# EAGLE design DeviceDOut8 (EAGLE 5.00)
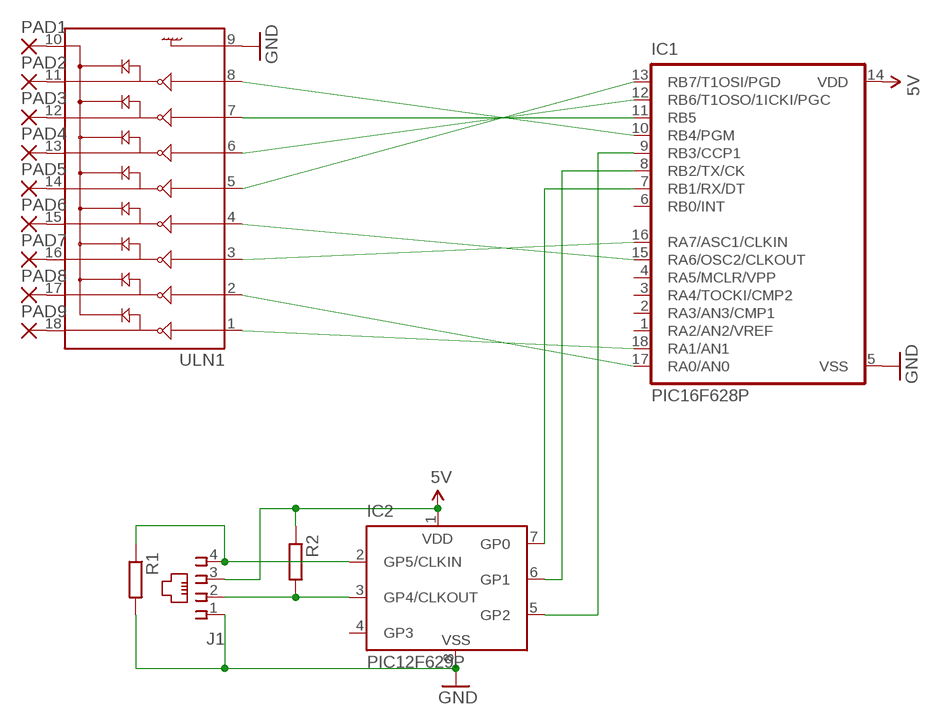
[diagram p0: schematic, sheet 1]

## Parts
IC1  PIC16F628P  [DIL18]
IC2  PIC12F629P  [DIL8]
J1  215875-3  [215875-3]
PAD1  2,15/1,0  [2,15/1,0]
PAD2  2,15/1,0  [2,15/1,0]
PAD3  2,15/1,0  [2,15/1,0]
PAD4  2,15/1,0  [2,15/1,0]
PAD5  2,15/1,0  [2,15/1,0]
PAD6  2,15/1,0  [2,15/1,0]
PAD7  2,15/1,0  [2,15/1,0]
PAD8  2,15/1,0  [2,15/1,0]
PAD9  2,15/1,0  [2,15/1,0]
R1  R-EU_0204/5  [0204/5]
R2  R-EU_0204/5  [0204/5]
ULN1  ULN2803DIP  [DIL18]

## Nets
5V: IC1.14(VDD) IC2.1(VDD) J1.3 R2.1
GND: IC1.5(VSS) IC2.8(VSS) J1.1 R1.2 ULN1.9
N$1: PAD1.1(P) ULN1.10
N$2: PAD2.1(P) ULN1.11
N$3: PAD3.1(P) ULN1.12
N$4: PAD4.1(P) ULN1.13
N$5: PAD5.1(P) ULN1.14
N$6: PAD6.1(P) ULN1.15
N$7: PAD7.1(P) ULN1.16
N$8: PAD8.1(P) ULN1.17
N$9: PAD9.1(P) ULN1.18
N$10: IC1.18(RA1/AN1) ULN1.1
N$11: IC2.3(GP4/CLKOUT) J1.2 R2.2
N$12: IC1.17(RA0/AN0) ULN1.2
N$13: IC1.16(RA7/ASC1/CLKIN) ULN1.3
N$14: IC1.15(RA6/OSC2/CLKOUT) ULN1.4
N$15: IC1.13(RB7/T1OSI/PGD) ULN1.5
N$16: IC1.12(RB6/T1OSO/1ICKI/PGC) ULN1.6
N$17: IC1.11(RB5) ULN1.7
N$18: IC1.10(RB4/PGM) ULN1.8
N$20: IC1.7(RB1/RX/DT) IC2.7(GP0)
N$21: IC1.8(RB2/TX/CK) IC2.6(GP1)
N$22: IC1.9(RB3/CCP1) IC2.5(GP2)
N$25: IC2.2(GP5/CLKIN) J1.4 R1.1
Unconnected: IC1.1(RA2/AN2/VREF) IC1.2(RA3/AN3/CMP1) IC1.3(RA4/TOCKI/CMP2) IC1.4(RA5/MCLR/VPP) IC1.6(RB0/INT) IC2.4(GP3)

## Library data of the parts
IC1 = microchip:PIC16*F62: FLASH-Based 8-Bit CMOS Microcontroller Source: http://ww1.microchip.com/downloads/en/DeviceDoc/40300C.pdf
IC2 = microchip:PIC12F6*: Data Sheet 8-Pin FLASH-Based 8-Bit CMOS Microcontrollers Source: http://www.microchip.com .. 41190c.pdf
J1 = con-amp:215875-3: AMP connector
PAD1-PAD9 = wirepad:2,15/1,0: THROUGH-HOLE PAD
R1 R2 = resistor:R-EU_: RESISTOR, European symbol
ULN1 = SparkFun:ULN2803: Darlington Driver ULN2803 Darlington array. 500mA max per channel, 8-channel package. Spark Fun Electronics SKU : COM-00312

## Board
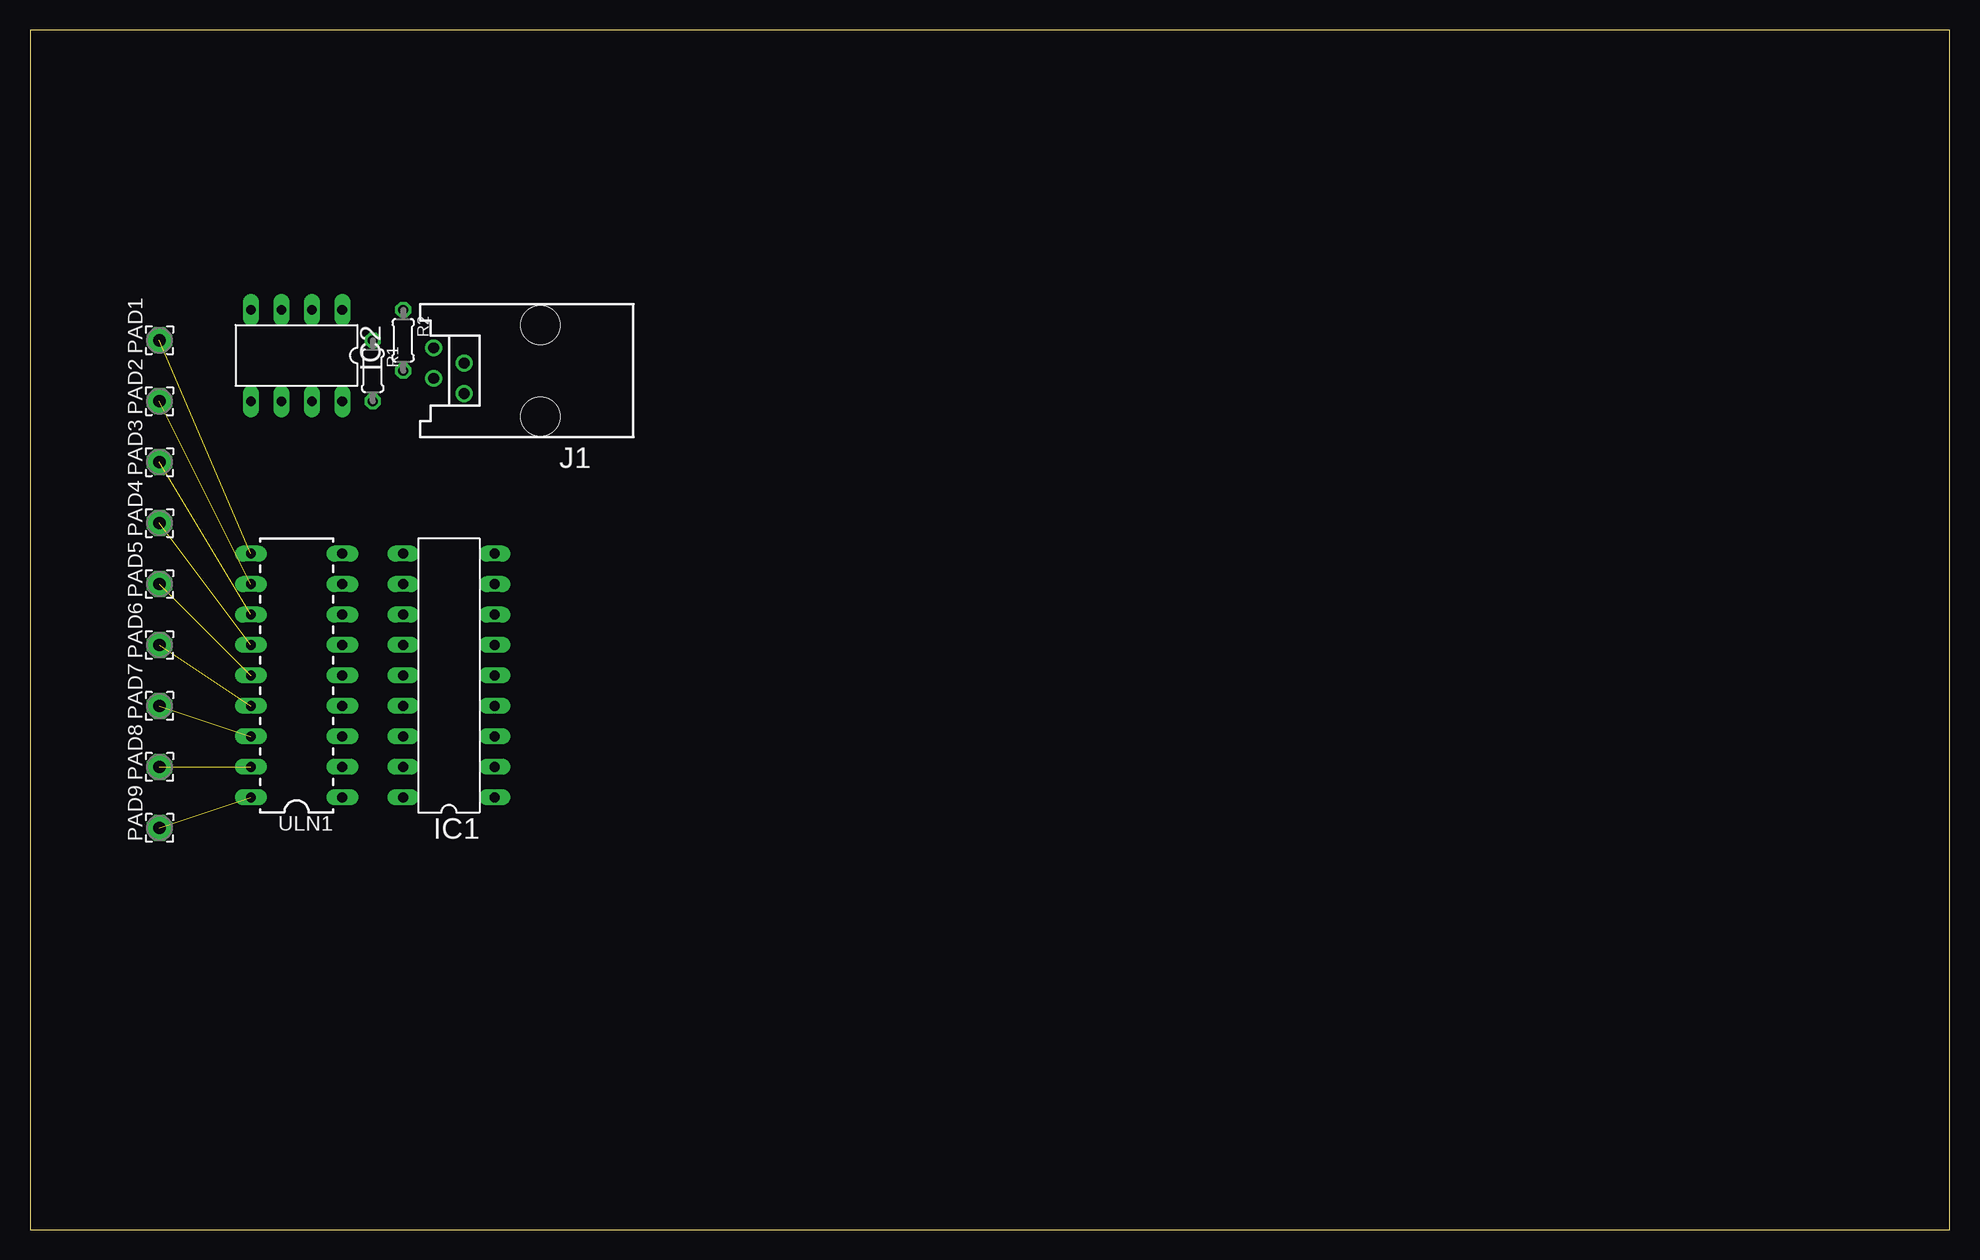
[diagram p1: board, top side]
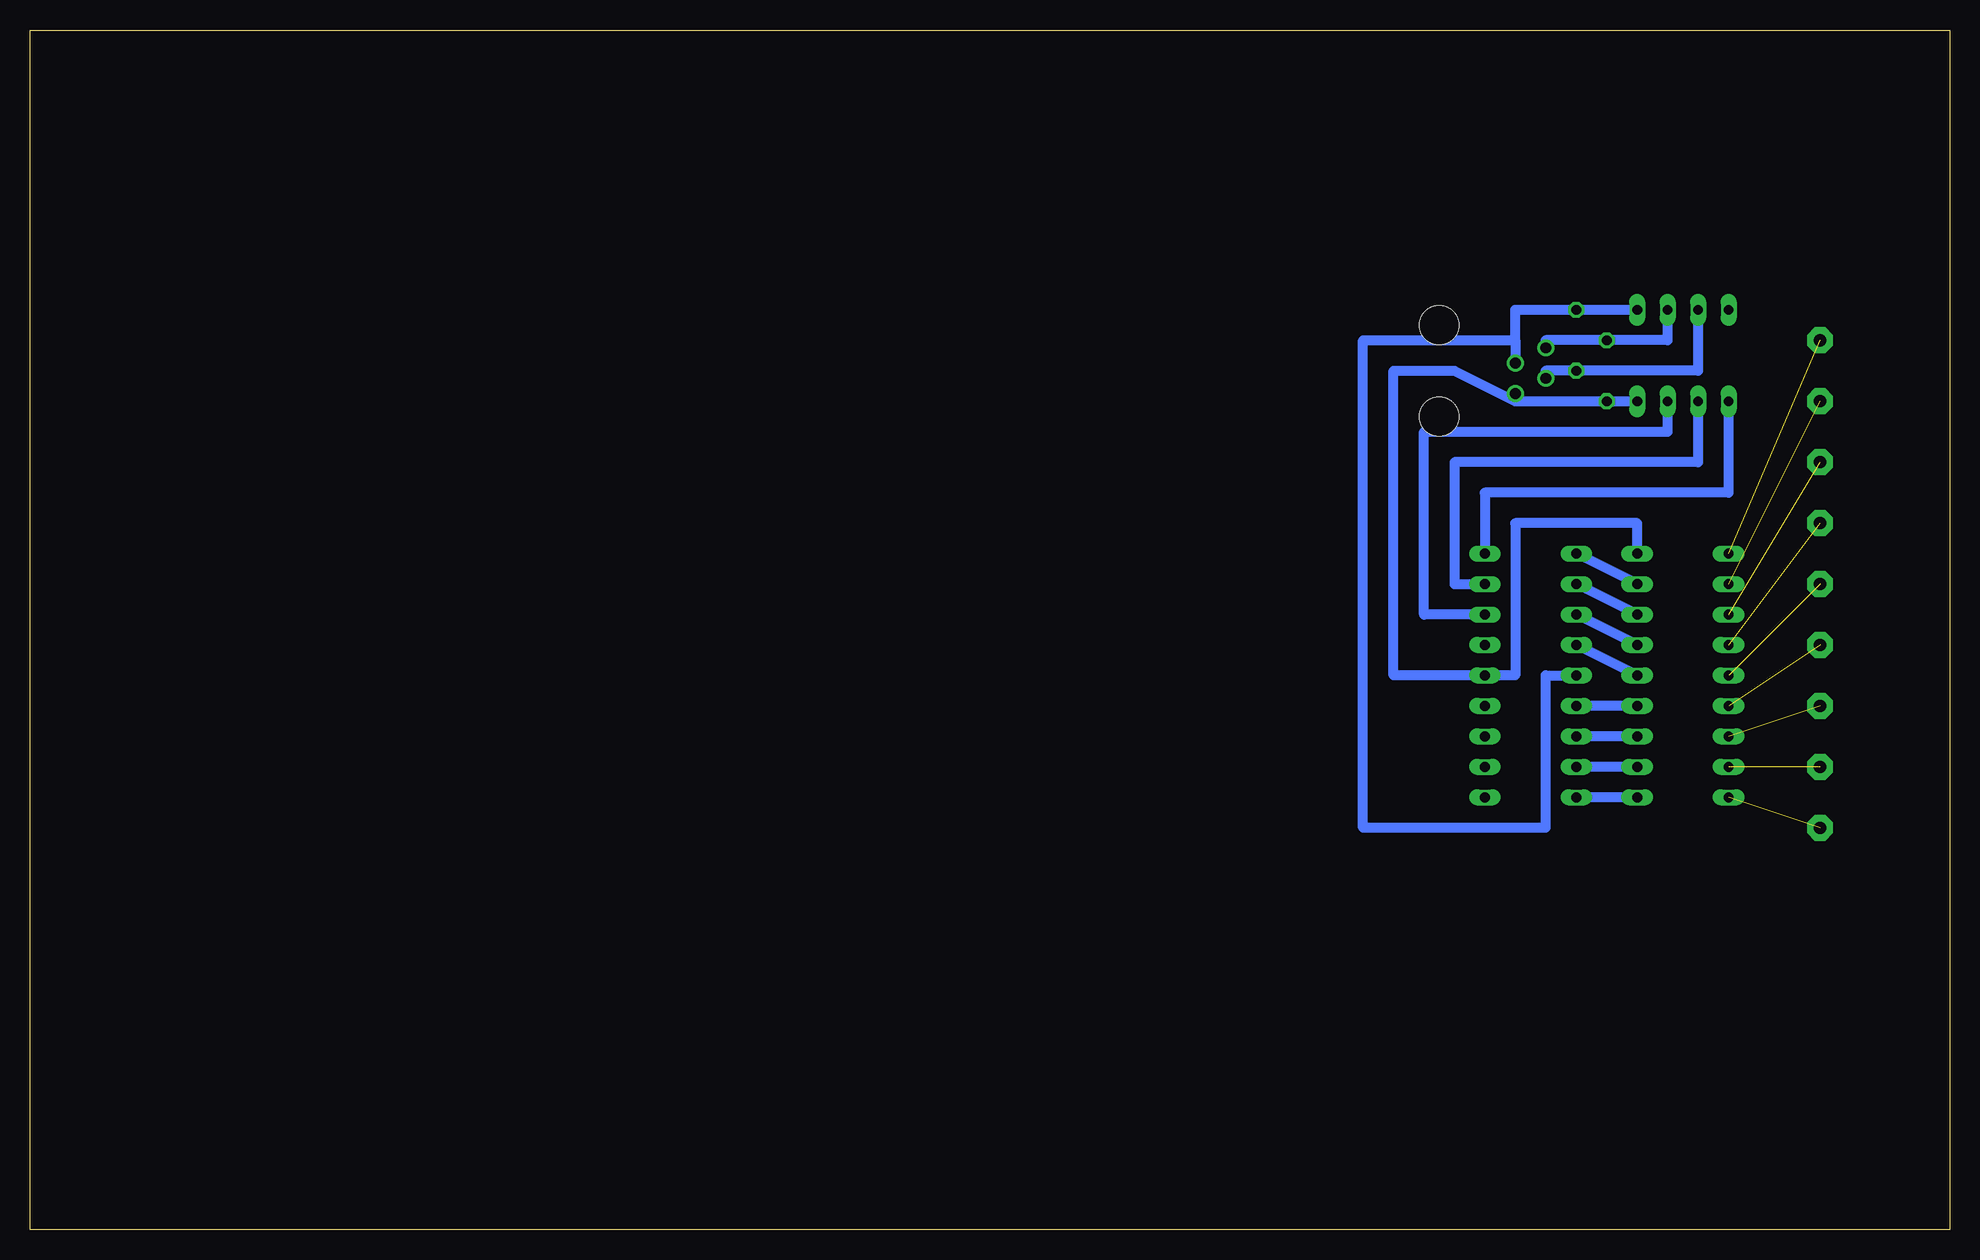
[diagram p2: board, bottom side, seen from below]

Size 160 x 100 mm. Coordinates in mm from the lower left corner, seen from the top.
Outline: 0,0 160,0 160,100 0,100 0,0
Copper layers (1*16): Top 0.035mm / dielectric 1.5mm / Bottom 0.035mm
Design rules "default": minimum track width 10mil, minimum drill 24mil, track to track 8mil, track to pad 8mil, pad to pad 8mil, via to via 8mil, smd to smd 8mil, copper to edge 40mil, drill to drill 8mil, minimum pad ring 10mil, minimum via ring 8mil, stop-mask expansion 4mil, vias tented up to drill 0mil, thermal gap 10mil

### Footprints (pad centres in the part's own frame; a part is rotated, then mirrored left to right if it is on the bottom)
DIL18 = drill 0.813 long: 1 -10.16,-3.81; 2 -7.62,-3.81; 3 -5.08,-3.81; 4 -2.54,-3.81; 5 0,-3.81; 6 2.54,-3.81; 7 5.08,-3.81; 8 7.62,-3.81; 9 10.16,-3.81; 10 10.16,3.81; 11 7.62,3.81; 12 5.08,3.81; 13 2.54,3.81; 14 0,3.81; 15 -2.54,3.81; 16 -5.08,3.81; 17 -7.62,3.81; 18 -10.16,3.81
DIL8 = drill 0.813 long: 1 -3.81,-3.81; 2 -1.27,-3.81; 3 1.27,-3.81; 4 3.81,-3.81; 5 3.81,3.81; 6 1.27,3.81; 7 -1.27,3.81; 8 -3.81,3.81
215875-3 = drill 0.889 round: 1 -1.905,6.35; 2 -0.635,8.89; 3 0.635,6.35; 4 1.905,8.89 | hole 3.251: -3.81,0; 3.81,0
2,15/1,0 = drill 1.016 pad 2.159 octagon: 1 0,0
0204/5 = drill 0.813 octagon: 1 -2.54,0; 2 2.54,0

### Placement (x,y rotation side)
IC1  34.92,46.19 90 top
IC2  22.22,72.86 180 top
J1  42.54,71.59 90 top
PAD1  10.79,74.13 90 top
PAD2  10.79,69.05 90 top
PAD3  10.79,63.97 90 top
PAD4  10.79,58.89 90 top
PAD5  10.79,53.81 90 top
PAD6  10.79,48.73 90 top
PAD7  10.79,43.65 90 top
PAD8  10.79,38.57 90 top
PAD9  10.79,33.49 90 top
R1  28.57,71.59 270 top
R2  31.11,74.13 270 top
ULN1  22.22,46.19 90 top

### Tracks (layer width: path | path; a pad name or v marks a point on that pad's centre or on a via)
5V
  Bottom 0.813: 36.19,74.13 36.19,76.67 R2.1 IC2.1 | 36.19,74.13 J1.3 | IC1.14 33.65,46.19 33.65,33.49 48.89,33.49 48.89,74.13 36.19,74.13
GND
  Bottom 0.813: IC2.8 R1.2 36.19,69.05 | 36.19,69.05 J1.1 | ULN1.9 26.03,58.89 36.19,58.89 36.19,46.19 IC1.5 46.35,46.19 46.35,71.59 41.27,71.59 36.19,69.05
N$1  (1 unrouted)
N$2  (1 unrouted)
N$3  (1 unrouted)
N$4  (1 unrouted)
N$5  (1 unrouted)
N$6  (1 unrouted)
N$7  (1 unrouted)
N$8  (1 unrouted)
N$9  (1 unrouted)
N$10
  Bottom 0.813: ULN1.1 IC1.18
N$11
  Bottom 0.813: J1.2 33.65,71.59 R2.2 20.95,71.59 IC2.3
N$12
  Bottom 0.813: ULN1.2 IC1.17
N$13
  Bottom 0.813: ULN1.3 IC1.16
N$14
  Bottom 0.813: ULN1.4 IC1.15
N$15
  Bottom 0.813: ULN1.5 IC1.13
N$16
  Bottom 0.813: ULN1.6 IC1.12
N$17
  Bottom 0.813: ULN1.7 IC1.11
N$18
  Bottom 0.813: ULN1.8 IC1.10
N$20
  Bottom 0.813: IC1.7 43.81,51.27 43.81,66.51 23.49,66.51 IC2.7
N$21
  Bottom 0.813: IC1.8 41.27,53.81 41.27,63.97 20.95,63.97 IC2.6
N$22
  Bottom 0.813: IC1.9 38.73,61.43 18.41,61.43 IC2.5
N$25
  Bottom 0.813: J1.4 33.65,74.13 R1.1 23.49,74.13 IC2.2